# Altium schematic sheet wifi_module.SchDoc
size A4; SheetNumber: 12; SheetTotal: 12
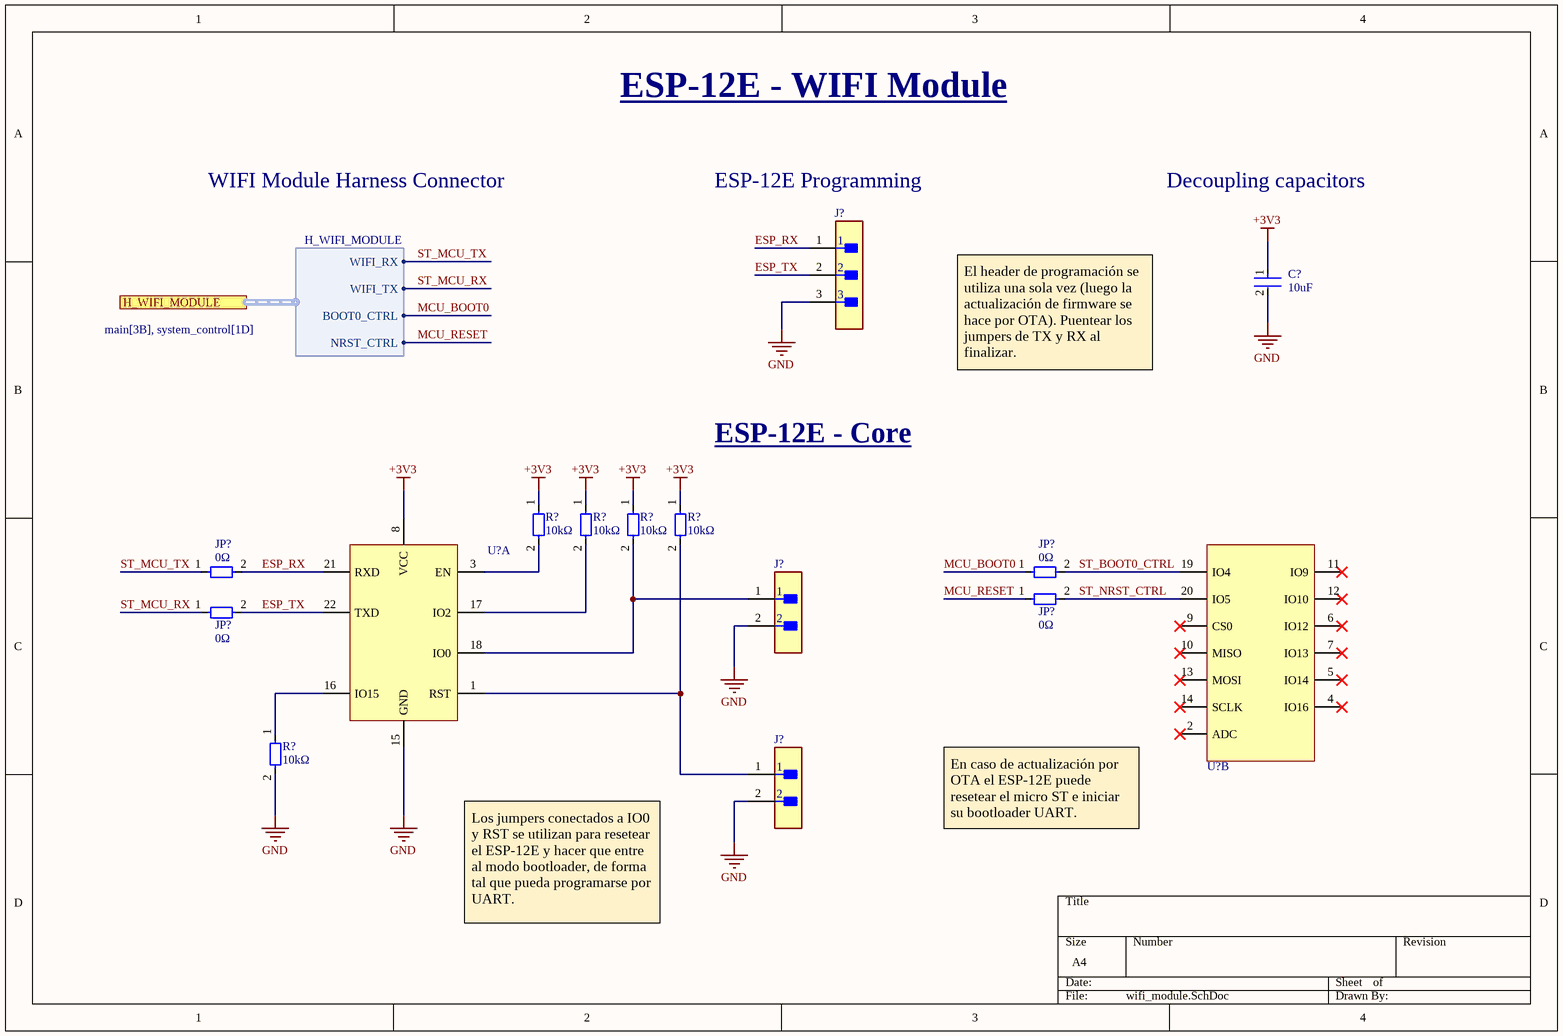
[diagram p0: wifi_module.SchDoc]

## Parts
(Parts that share a designator on the sheet are numbered #1, #2 ... from top to bottom, then left to right.)
C?  Capacitance: 10uF  [CAP_0805]  (hidden comment: Simbolo de capacitor genérico)
J?#1  22-11-1031  [FP-0022111031-MFG]  (value not drawn)
J?#2  4-103185-0-02  [FP-4-103185-0-02-MFG]  (value not drawn)
J?#3  4-103185-0-02  [FP-4-103185-0-02-MFG]  (value not drawn)
JP?#1  value 0Ω  [RES_0R_0603]  (hidden comment: Generic JP)  (no BOM)
JP?#2  value 0Ω  [RES_0R_0603]  (hidden comment: Generic JP)  (no BOM)
JP?#3  value 0Ω  [RES_0R_0603]  (hidden comment: Generic JP)  (no BOM)
JP?#4  value 0Ω  [RES_0R_0603]  (hidden comment: Generic JP)  (no BOM)
R?#1  value 10kΩ  [RES_0805]  (hidden comment: Simbolo de resistencia genérica)
R?#2  value 10kΩ  [RES_0805]  (hidden comment: Simbolo de resistencia genérica)
R?#3  value 10kΩ  [RES_0805]  (hidden comment: Simbolo de resistencia genérica)
R?#4  value 10kΩ  [RES_0805]  (hidden comment: Simbolo de resistencia genérica)
R?#5  value 10kΩ  [RES_0805]  (hidden comment: Simbolo de resistencia genérica)
U?#1  ESP-12E module  [ESP-12E]  (value not drawn)  (part A of 2)
U?#2  ESP-12E module  [ESP-12E]  (value not drawn)  (part B of 2)

## Ports
H_WIFI_MODULE (harness H_WIFI_MODULE, see main[3B], system_control[1D])

## Harnesses
H_WIFI_MODULE: WIFI_TX, WIFI_RX, BOOT0_CTRL, NRST_CTRL

## Nets
+3V3: C?.1 R?#1.1 R?#2.1 R?#3.1 R?#4.1 U?#1.8(VCC)
GND: C?.2 J?#1.3 J?#2.2 J?#3.2 R?#5.2 U?#1.15(GND)
ESP_RX: J?#1.1 JP?#1.2 U?#1.21(RXD)
ESP_TX: J?#1.2 JP?#4.2 U?#1.22(TXD)
MCU_BOOT0: JP?#2.1 ; port H_WIFI_MODULE.BOOT0_CTRL
MCU_RESET: JP?#3.1 ; port H_WIFI_MODULE.NRST_CTRL
ST_BOOT0_CTRL: JP?#2.2 U?#2.19(IO4)
ST_MCU_RX: JP?#4.1 ; port H_WIFI_MODULE.WIFI_TX
ST_MCU_TX: JP?#1.1 ; port H_WIFI_MODULE.WIFI_RX
ST_NRST_CTRL: JP?#3.2 U?#2.20(IO5)
NetJ?#2_1: J?#2.1 R?#3.2 U?#1.18(IO0)
NetJ?#3_1: J?#3.1 R?#4.2 U?#1.1(RST)
NetR?#1_2: R?#1.2 U?#1.3(EN)
NetR?#2_2: R?#2.2 U?#1.17(IO2)
NetR?#5_1: R?#5.1 U?#1.16(IO15)

Not connected (* = marked no-connect by the designer): U?#2 2(ADC)* 4(IO16)* 5(IO14)* 6(IO12)* 7(IO13)* 9(CS0)* 10(MISO)* 11(IO9)* 12(IO10)* 13(MOSI)* 14(SCLK)*

## Notes on the sheet
- ESP-12E - WIFI Module
- WIFI Module Harness Connector
- ESP-12E Programming
- Decoupling capacitors
- El header de programación se utiliza una sola vez (luego la actualización de firmware se hace por OTA). Puentear los jumpers de TX y RX al finalizar.
- ESP-12E - Core
- En caso de actualización por OTA el ESP-12E puede resetear el micro ST e iniciar su bootloader UART.
- Los jumpers conectados a IO0 y RST se utilizan para resetear el ESP-12E y hacer que entre al modo bootloader, de forma tal que pueda programarse por UART.

## Library data of the parts
C? = Generic C: Dielectric: X5R; Voltage Rating: 10V; Tolerance: 10%; Case Code (Imperial): 0805; Mount: Surface Mount; Depth: 1.25mm; Length: 2mm; Lead Free: Lead Free; Packaging: Tape and Reel; Width: 0.049inch; Package Quantity: 1; Height: 1.25mm; Case/Package: 0805; Thickness: 0.053inch; Max Operating Temperature: 85°C; Case Code (Metric): 2012; Contact Plating: Tin; Min Operating Temperature: -55°C; Radiation Hardening: No; Voltage Rating (DC): 10V
J?#1 = CMP-00257-00247512-1: 22-11-1031 Mini-Latch™ Wire-to-Board Header, Vertical, with Friction Ramp, 3 Circuits, Gold (Au) Plating; Manufacturer Lifecycle Status: ACTIVE; NexarPartId: 247512; Number of Positions: 3; Current Rating: 3A; Gender: Male; Pitch: 2.5mm; Connector Type: Male Pin; Contact Resistance: 20mΩ; Voltage Rating: 250V; Max Voltage Rating (DC): 250.25kV; Color: Natural; Fastening Type: Friction; RoHS: Compliant; Contact Mating Length: 7.493mm; Lifecycle Status: Production; Number of Rows: 1; Schedule B: 8536694040, 8536694040; Radiation Hardening: No; Number of Contacts: 3; Depth: 4.9mm; Termination: Solder; Housing Color: Natural; Max Operating Temperature: 105°C; Mount: Through Hole; Height: 12.1mm; Lead Free: Lead Free; Contact Gender: Male; Plating: Gold; Contact Material: Brass; Length: 7mm; Country of Origin: KR; Housing Material: Nylon; Number of Circuits: 3; Contact Plating: Gold; Packaging: Bulk; Orientation: Vertical; Min Operating Temperature: -40°C; REACH SVHC: Unknown
J?#2 J?#3 = CMP-06573-39509931-1: 4-103185-0-02 Conn Header Vert 2POS 2.54MM; Connector Type: Male Pin; Number of Contacts: 2; Gender: Male; Width: 2.34mm; Contact Plating: Gold; Number of Rows: 1; Pitch: 2.54mm; Termination: Solder; Housing Color: Black; Mount: Through Hole; Contact Mating Length: 5.842mm; Housing Material: Plastic; Length: 4.67mm; Number of Positions: 2; Packaging: Bulk; NexarPartId: 39509931; Contact Material: Bronze; Lead Free: Contains Lead; Case/Package: 100; Color: Black; RoHS: Non-Compliant; Height: 2.29mm
JP?#1-JP?#4 = Generic JP: Simbolo de jumper genérico
R?#1-R?#5 = Generic R
U?#1 U?#2 = ESP-12E: Wi-Fi module ESP-12E 3.3V.; Value: ESP-12E; LCSC Part #: C89297; Datasheet: https://components101.com/sites/default/files/2021-09/ESP12E-Datasheet.pdf